# EAGLE design schaltung_endstuffe (EAGLE 9.2.0)
ABTEILUNG: Technische Informatik; BEARBEITER: Andrej Tica; DATUM: 21.10.2019; DOKUMENTART: Schaltplan; GEZ: TicA; ID: 4AHEL; SCHALTPLAN: Endstuffe_4xSE; STATUS: Prototyp; VER: 1.0
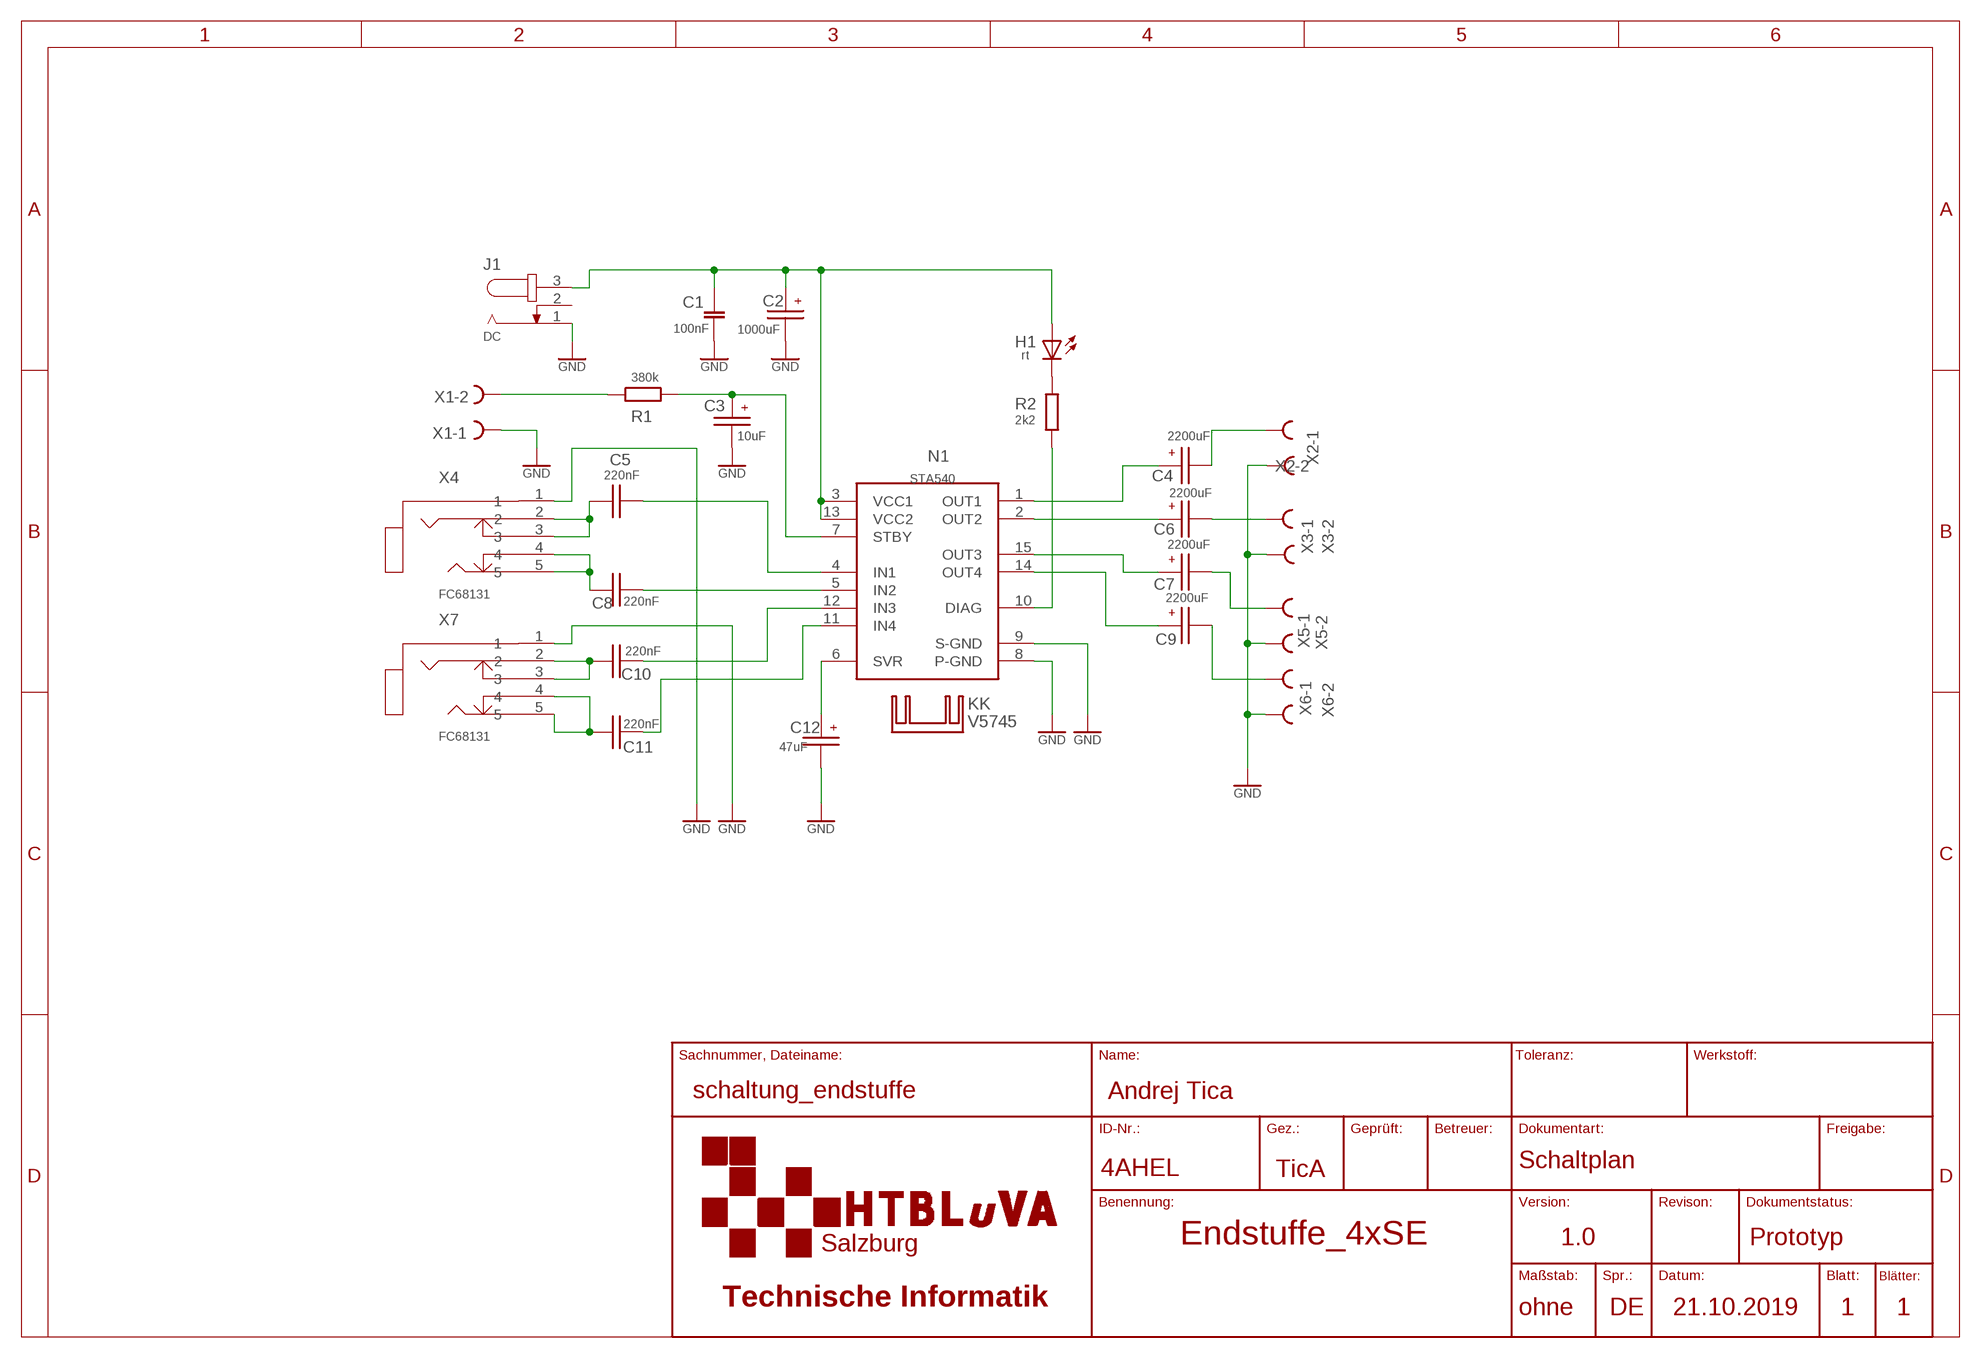
[diagram p0: schematic, sheet 1]

## Parts
C1  100nF  C-EU1206  [MYLIB_C1206]
C2  1000uF  CPOL-V_E7.5-16  [E7,5-16]
C3  10uF  CPOL-V_E3.5-8  [E3,5-8]
C4  2200uF  CPOL-V_E7.5-16  [E7,5-16]
C5  220nF  C-V_050-025X075  [C050-025X075]
C6  2200uF  CPOL-V_E7.5-16  [E7,5-16]
C7  2200uF  CPOL-V_E7.5-16  [E7,5-16]
C8  220nF  C-V_050-025X075  [C050-025X075]
C9  2200uF  CPOL-V_E7.5-16  [E7,5-16]
C10  220nF  C-V_050-025X075  [C050-025X075]
C11  220nF  C-V_050-025X075  [C050-025X075]
C12  47uF  CPOL-V_E3.5-8  [E3,5-8]
H1  rt  LED_5MM  [LED5MM]
J1  DC  JACK-PLUG0  [SPC4077]
KK  V5745  [V5745]
N1  STA540  [MULTIWATT15]
R1  380k  R-H_0204/7  [0204/7]
R2  2k2  R-H_0204/7  [0204/7]
X1  AK500/2  [AK500/2]
X2  AK500/2  [AK500/2]
X3  AK500/2  [AK500/2]
X4  FC68131  [FC68131-5P]
X5  AK500/2  [AK500/2]
X6  AK500/2  [AK500/2]
X7  FC68131  [FC68131-5P]

## Nets
GND: C1.+ C2.- C3.- C12.- J1.1 N1.8(P-GND) N1.9(S-GND) X1.1 X2.1 X3.2 X4.1 X5.2 X6.2 X7.1
N$1: C3.+ N1.7(STBY) R1.2
N$2: C1.- C2.+ H1.A J1.3 N1.3(VCC1) N1.13(VCC2)
N$3: C5.1 X4.2 X4.3
N$4: C10.2 N1.12(IN3)
N$5: C8.2 N1.5(IN2)
N$6: C10.1 X7.2 X7.3
N$7: C8.1 X4.4 X4.5
N$8: C11.2 N1.11(IN4)
N$9: C5.2 N1.4(IN1)
N$10: C4.+ N1.1(OUT1)
N$11: C4.- X2.2
N$12: C11.1 X7.4 X7.5
N$13: C6.+ N1.2(OUT2)
N$14: C12.+ N1.6(SVR)
N$15: C7.+ N1.15(OUT3)
N$16: C9.+ N1.14(OUT4)
N$17: C6.- X3.1
N$18: C9.- X6.1
N$19: C7.- X5.1
N$20: R1.1 X1.2
N$21: H1.K(C) R2.2
N$22: N1.10(DIAG) R2.1
Unconnected: J1.2

## Library data of the parts
C1 = rcl_TicA:C-EU
C2-C4 C6 C7 C9 C12 = rcl_TicA:CPOL-V_: POLARIZED CAPACITOR, European symbol
C5 C8 C10 C11 = rcl_TicA:C-V_: CAPACITOR, European symbol
H1 = led_TicA:LED_: LED OSRAM: - CHIPLED LG R971, LG N971, LY N971, LG Q971, LY Q971, LO R971, LY R971 LH N974, LH R974 LS Q976, LO Q976, LY Q976 LO Q996 - Hyper CHIPLED LW Q18S LB Q993, LB Q99A, LB R99A - SideLED LS A670, LO A670, LY A670, LG A670, LP A670 LB A673, LV A673, LT A673, LW A673 LH A674 LY A675 LS A676, LA A676, LO A676, LY A676, LW A676 LS A679, LY A679, LG A679 - Hyper Micro SIDELED® LS Y876, LA Y876, LO Y876, LY Y876 LT Y87S - SmartLED LW L88C, LW L88S LB L89C, LB L89S, LG L890 LS L89K, LO L89K, LY L89K LS L896, LA L896, LO L896, LY L896 - TOPLED LS T670, LO T670, LY T670, LG T670, LP T670 LSG T670, LSP T670, LSY T670, LOP T670, LYG T670 LG T671, LOG T671, LSG T671 LB T673, LV T673, LT T673, LW T673 LH T674 LS T676, LA T676, LO T676, LY T676, LB T676, LH T676, LSB T676, LW T676 LB T67C, LV T67C, LT T67C, LS T67K, LO T67K, LY T67K, LW E67C LS E67B, LA E67B, LO E67B, LY E67B, LB E67C, LV E67C, LT E67C LW T67C LS T679, LY T679, LG T679 LS T770, LO T770, LY T770, LG T770, LP T770 LB T773, LV T773, LT T773, LW T773 LH T774 LS E675, LA E675, LY E675, LS T675 LS T776, LA T776, LO T776, LY T776, LB T776 LHGB T686 LT T68C, LB T68C - Hyper Mini TOPLED® LB M676 - Mini TOPLED Santana® LG M470 LS M47K, LO M47K, LY M47K Source: http://www.osram.convergy.de LUXEON: - LUMILED® LXK2-PW12-R00, LXK2-PW12-S00, LXK2-PW14-U00, LXK2-PW14-V00 LXK2-PM12-R00, LXK2-PM12-S00, LXK2-PM14-U00 LXK2-PE12-Q00, LXK2-PE12-R00, LXK2-PE12-S00, LXK2-PE14-T00, LXK2-PE14-U00 LXK2-PB12-K00, LXK2-PB12-L00, LXK2-PB12-M00, LXK2-PB14-N00, LXK2-PB14-P00, LXK2-PB14-Q00 LXK2-PR12-L00, LXK2-PR12-M00, LXK2-PR14-Q00, LXK2-PR14-R00 LXK2-PD12-Q00, LXK2-PD12-R00, LXK2-PD12-S00 LXK2-PH12-R00, LXK2-PH12-S00 LXK2-PL12-P00, LXK2-PL12-Q00, LXK2-PL12-R00 Source: www.luxeon.com KINGBRIGHT: KA-3528ASYC Source: www.kingbright.com
J1 = con-jack:JACK-PLUG: DC POWER JACK Power Jack, DC, Right Angle, Through Hole, Rated 5A at 16VDC, PC Terminals Distributor: Farnell (www.Farnell.de) Drawing: 84N1161.pdf / 84N1162.pdf Manufacturer: SPC Technology (www.spctechnology.com) Type: SPC4077 / SPC 4078; OC_FARNELL: unknown; OC_NEWARK: unknown
KK = heatsink_TicA:V5745: HEATSINK manufacturer Fischer/distributor Buerklin
N1 = STA540:STA540: Multiwatt package for L298 bridge driver; AVAILABILITY: Unavailable; DESCRIPTION: Audio Amp Speaker 1-CH Mono/2-CH Stereo/4-CH Stereo 34W Class-AB 15-Pin_15+Tab_ MULTIWATT V Tube; MF: STMicroelectronics; MP: STA540; PACKAGE: Multiwatt-15 Lumex; PRICE: None
R1 R2 = rcl_TicA:R-H_: RESISTOR, European symbol
X1-X3 X5 X6 = con_TicA:AK500/2: CONNECTOR; OC_FARNELL: unknown; OC_NEWARK: unknown
X4 X7 = FC68131:FC68131; AVAILABILITY: Unavailable; DESCRIPTION: Stereo Jack, 3.5mm, 3pos, Pcb; MF: Cliff; MP: FC68131; PACKAGE: None; PRICE: None

## Board
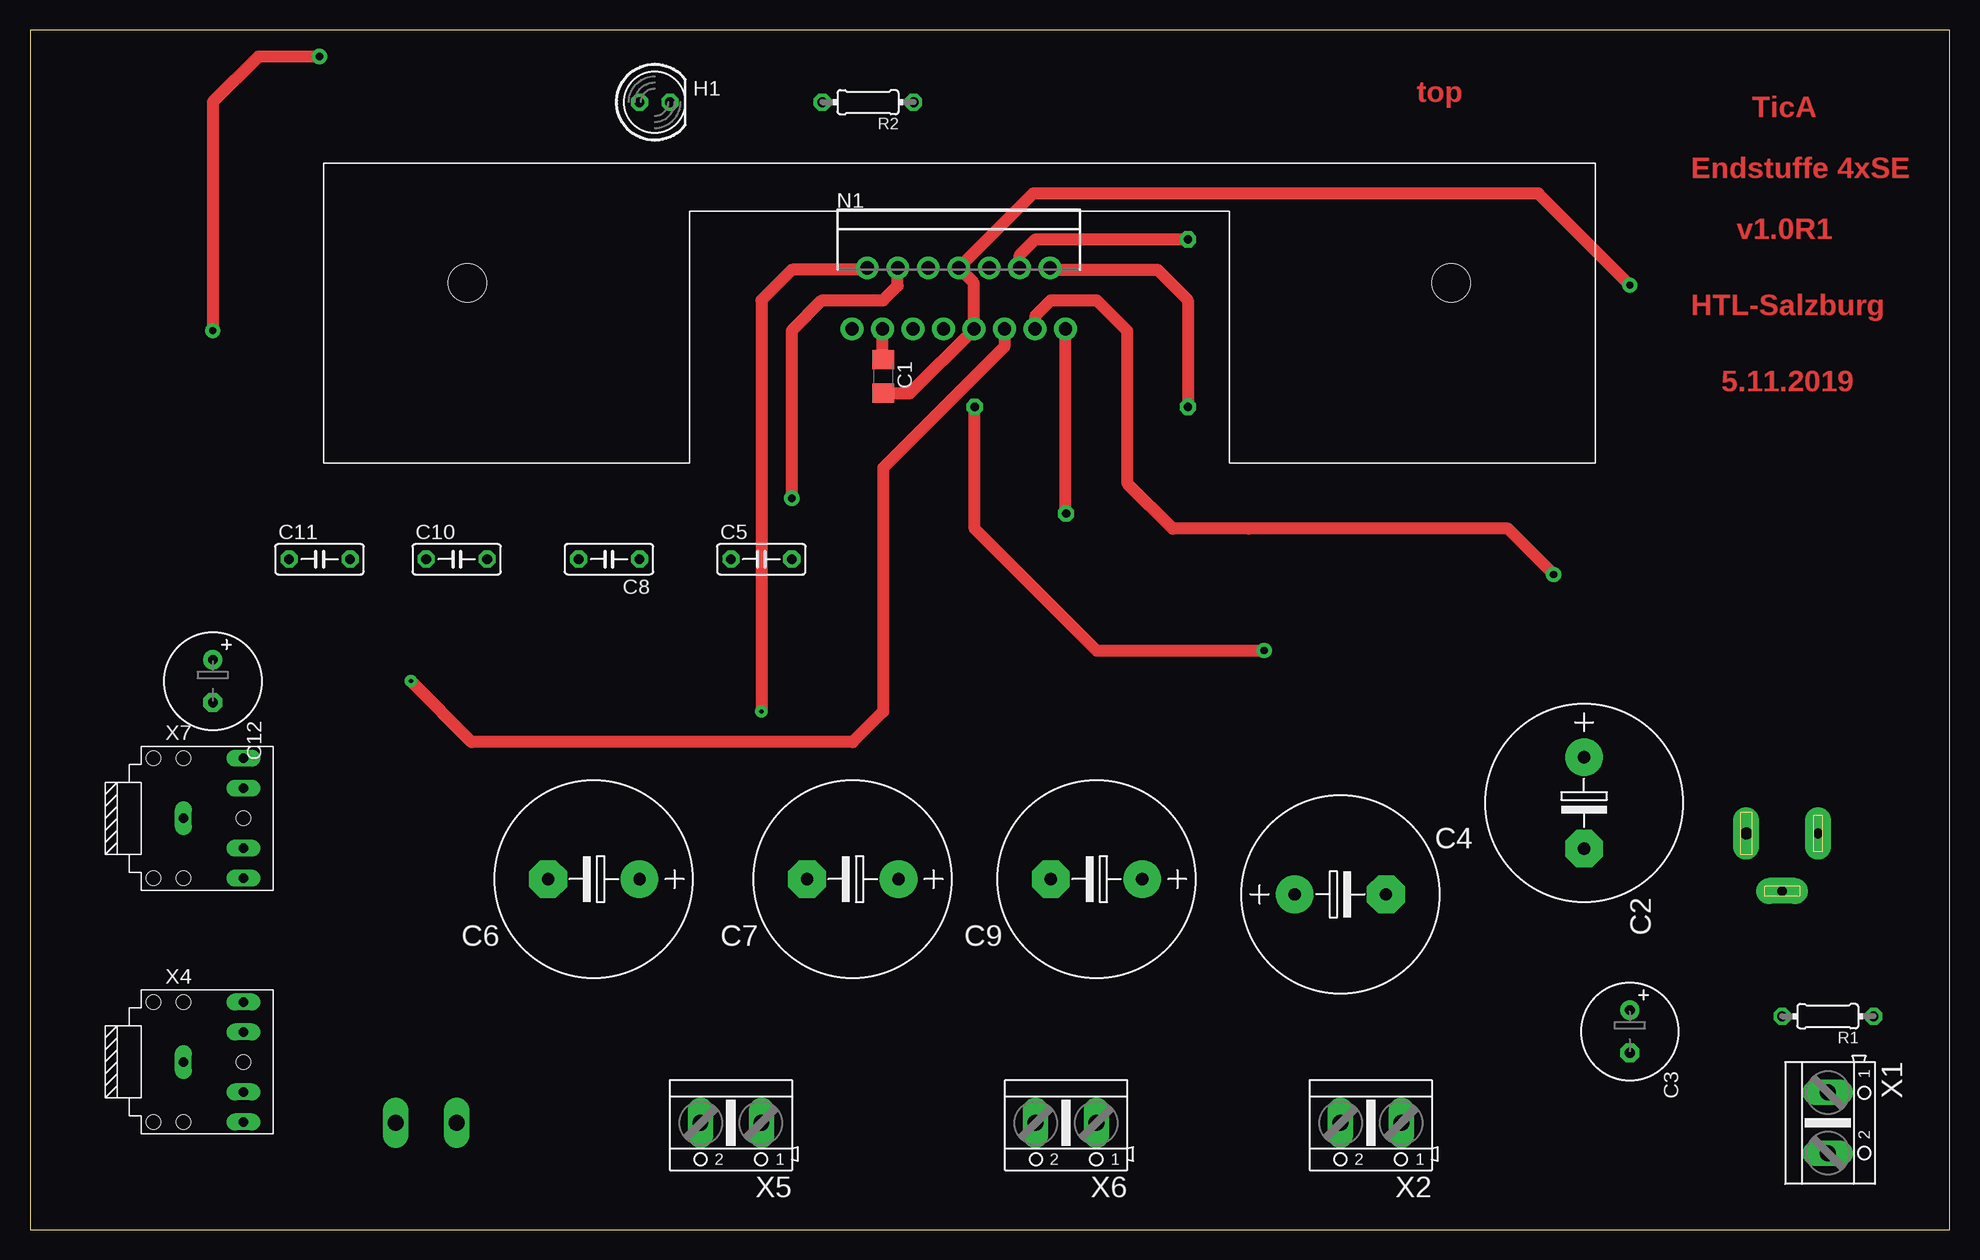
[diagram p1: board, top side]
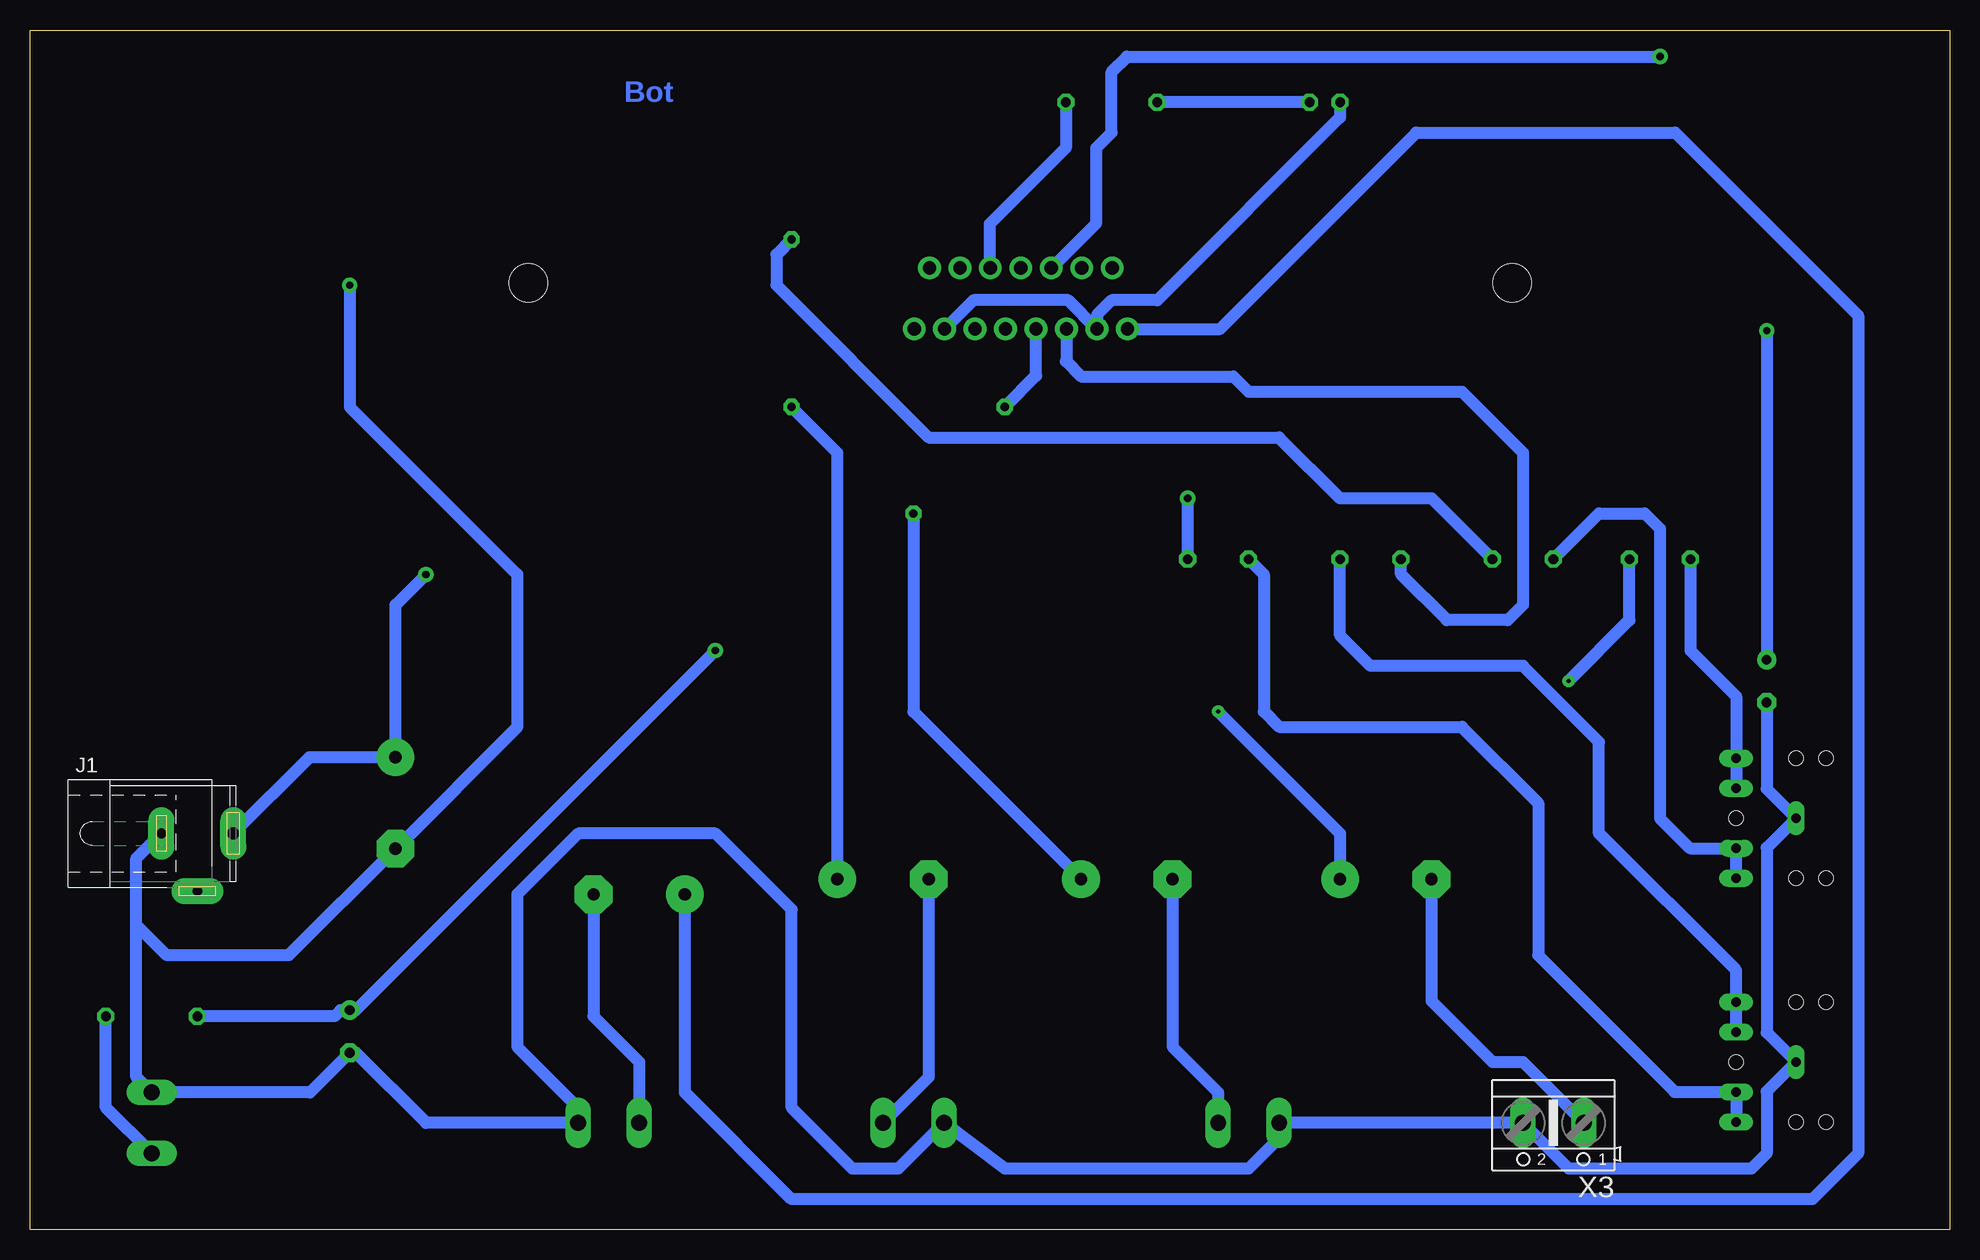
[diagram p2: board, bottom side, seen from below]

Size 160 x 100 mm. Coordinates in mm from the lower left corner, seen from the top.
Outline: 0,0 160,0 160,100 0,100 0,0
Copper layers (1+16): Top 0.035mm / dielectric 1.5mm / Bottom 0.035mm
Design rules "HWE": minimum track width 16mil, minimum drill 0.6mm, track to track 10mil, track to pad 10mil, pad to pad 8mil, via to via 8mil, smd to smd 8mil, copper to edge 20mil, drill to drill 8mil, minimum pad ring 12mil, minimum via ring 13mil, stop-mask expansion 4mil, vias tented up to drill 0mil, thermal gap 40mil

### Footprints (pad centres in the part's own frame; a part is rotated, then mirrored left to right if it is on the bottom)
MYLIB_C1206 = smd 1.6 x 1.8: + 1.4,0; - -1.4,0
E7,5-16 = drill 1.016 pad 3.15: + -3.81,0 | drill 1.016 pad 3.15 octagon: - 3.81,0
E3,5-8 = drill 0.813 pad 1.6: + -1.778,0 | drill 0.813 pad 1.6 octagon: - 1.778,0
C050-025X075 = drill 0.813 octagon: 1 -2.54,0; 2 2.54,0
LED5MM = drill 0.8 octagon: A -1.27,0; K 1.27,0
SPC4077 = drill 0.8 pad 2.184 long: 1 -3,0; 2 0,-4.8 | drill 1 pad 2.184 long: 3 3,0
V5745 = hole 3.2: -41,10; 41,10
MULTIWATT15 = drill 1.1 pad 1.9: 1 -8.95,-2.39; 2 -7.68,2.69; 3 -6.41,-2.39; 4 -5.14,2.69; 5 -3.87,-2.39; 6 -2.6,2.69; 7 -1.33,-2.39; 8 -0.06,2.69; 9 1.21,-2.39; 10 2.48,2.69; 11 3.75,-2.39; 12 5.02,2.69; 13 6.29,-2.39; 14 7.56,2.69; 15 8.83,-2.39
0204/7 = drill 0.813 octagon: 1 -3.81,0; 2 3.81,0
AK500/2 = drill 1.321 long: 1 -2.54,0; 2 2.54,0
FC68131-5P = drill 0.8 long: 1 -5,0; 2 0,-5; 3 0,-2.5; 4 0,2.5; 5 0,5 | hole 1.2: 0,0; -5,-5; -5,5; -7.5,5; -7.5,-5

### Placement (x,y rotation side)
C1  71.12,71.12 270 top
C2  129.54,35.56 270 top
C3  133.35,16.51 270 top
C4  109.22,27.94 0 top
C5  60.96,55.88 0 top
C6  46.99,29.21 180 top
C7  68.58,29.21 180 top
C8  48.26,55.88 180 top
C9  88.9,29.21 180 top
C10  35.56,55.88 0 top
C11  24.13,55.88 0 top
C12  15.24,45.72 270 top
H1  52.07,93.98 0 top
J1  146.05,33.02 0 bottom
KK  77.47,88.9 180 top
N1  77.47,77.47 0 top
R1  149.86,17.78 180 top
R2  69.85,93.98 180 top
X1  149.86,8.89 270 top
X2  111.76,8.89 180 top
X3  33.02,8.89 180 bottom
X4  17.78,13.97 0 top
X5  58.42,8.89 180 top
X6  86.36,8.89 180 top
X7  17.78,34.29 0 top

### Tracks (layer width: path | path; a pad name or v marks a point on that pad's centre or on a via)
GND  (via drill 0.6)
  Top 1.016: C1.+ 73.32,69.72 N1.9 78.68,78.89 N1.8 83.61,86.36 125.73,86.36 v133.35,78.74
  Bottom 1.016: C12.- 15.24,36.75 X7.1 15.24,31.83 15.24,16.43 X4.1 15.24,11.51 15.24,6.35 16.51,5.08 31.75,5.08 X3.2 X5.2 55.88,7.62 58.42,5.08 78.74,5.08 X6.2 87.63,5.08 91.44,5.08 96.52,10.16 96.52,26.67 102.87,33.02 114.3,33.02 119.38,27.94 119.38,15.24 114.3,10.16 X2.1 127,8.89 132.84,14.73 C3.- 136.65,11.43 X1.1 151.13,12.7 151.13,25.4 | J1.1 151.13,30.94 151.13,25.4 | 151.13,25.4 148.59,22.86 138.43,22.86 C2.- 119.38,41.91 119.38,54.61 133.35,68.58 v133.35,78.74
N$1  (via drill 0.6, 0.7)
  Top 1.016: v78.74,68.58 78.74,58.42 88.9,48.26 v102.87,48.26
  Bottom 1.016: v78.74,68.58 76.14,71.18 N1.7 | v102.87,48.26 132.84,18.29 C3.+ 134.11,18.29 134.62,17.78 R1.2
N$2  (via drill 0.6)
  Top 1.016: N1.13 83.82,75.14 83.82,76.2 85.09,77.47 88.9,77.47 91.44,74.93 91.44,62.23 95.25,58.42 101.6,58.42 123.19,58.42 v127,54.61 | C1.- 71.06,72.58 N1.3
  Bottom 1.016: H1.A 50.8,92.71 66.04,77.47 69.85,77.47 71.06,76.26 N1.3 73.45,77.47 81.37,77.47 N1.13 | J1.3 136.7,39.37 C2.+ 129.54,52.07 v127,54.61
N$3
  Bottom 1.016: C5.1 57.15,54.61 57.15,43.18 55.88,41.91 40.64,41.91 34.29,35.56 34.29,22.86 22.9,11.47 X4.3 X4.2
N$4  (via drill 0.7)
  Top 1.016: N1.12 82.49,81.22 83.82,82.55 v96.52,82.55
  Bottom 1.016: v96.52,82.55 97.79,81.28 97.79,78.74 85.09,66.04 55.88,66.04 50.8,60.96 43.18,60.96 C10.2
N$5
  Bottom 1.016: N1.5 73.6,72.45 73.66,72.39 72.39,71.12 59.69,71.12 58.42,69.85 40.64,69.85 35.56,64.77 35.56,52.07 36.83,50.8 41.91,50.8 45.72,54.61 C8.2
N$6
  Bottom 1.016: C10.1 29.21,59.69 25.4,59.69 24.13,58.42 24.13,34.29 21.63,31.79 X7.3 X7.2
N$7
  Bottom 1.016: C8.1 50.8,49.53 48.26,46.99 35.56,46.99 29.21,40.64 29.21,33.02 17.78,21.59 X4.5 X4.4
N$8  (via drill 0.35)
  Top 1.016: N1.11 81.22,73.6 71.12,63.5 71.12,43.18 68.58,40.64 36.83,40.64 v31.75,45.72
  Bottom 1.016: v31.75,45.72 26.67,50.8 C11.2
N$9  (via drill 0.61)
  Top 1.016: N1.4 72.33,78.68 71.12,77.47 66.04,77.47 63.5,74.93 v63.5,60.96
  Bottom 1.016: C5.2 v63.5,60.96
N$10
  Bottom 1.016: N1.1 60.81,75.08 44.45,91.44 22.86,91.44 7.62,76.2 7.62,6.35 11.43,2.54 96.52,2.54 105.41,11.43 C4.+
N$11
  Bottom 1.016: C4.- 113.03,17.78 109.22,13.97 X2.2
N$12
  Bottom 1.016: C11.1 21.59,48.26 17.78,44.45 X7.5 X7.4
N$13  (via drill 0.35)
  Top 1.016: N1.2 69.64,80.01 63.5,80.01 60.96,77.47 v60.96,43.18
  Bottom 1.016: v60.96,43.18 50.8,33.02 C6.+
N$14  (via drill 0.6)
  Top 1.016: v15.24,74.93 15.24,93.98 19.05,97.79 v24.13,97.79
  Bottom 1.016: v15.24,74.93 C12.+ | N1.6 71.12,83.91 71.12,90.17 69.85,91.44 69.85,96.52 68.58,97.79 v24.13,97.79
N$15  (via drill 0.7)
  Top 1.016: v86.36,59.69 86.3,59.75 N1.15
  Bottom 1.016: v86.36,59.69 86.36,43.18 C7.+
N$16  (via drill 0.7)
  Top 1.016: N1.14 85.18,80.01 93.98,80.01 96.52,77.47 v96.52,68.58
  Bottom 1.016: v96.52,68.58 92.71,64.77 C9.+
N$17
  Bottom 1.016: X3.1 35.56,13.97 38.1,13.97 43.18,19.05 C6.-
N$18
  Bottom 1.016: X6.1 85.09,12.7 C9.-
N$19
  Bottom 1.016: C7.- 64.77,15.24 60.96,11.43 X5.1
N$20
  Bottom 1.016: X1.2 153.67,10.16 R1.1
N$21
  Bottom 1.016: H1.K R2.2
N$22
  Bottom 1.016: R2.1 73.66,90.17 80.01,83.82 80.01,80.22 N1.10

### Text on the board
Top: top | TicA | Endstuffe 4xSE | v1.0R1 | HTL-Salzburg | 5.11.2019
Bottom: Bot